# Altium schematic sheet leds.SchDoc
size A
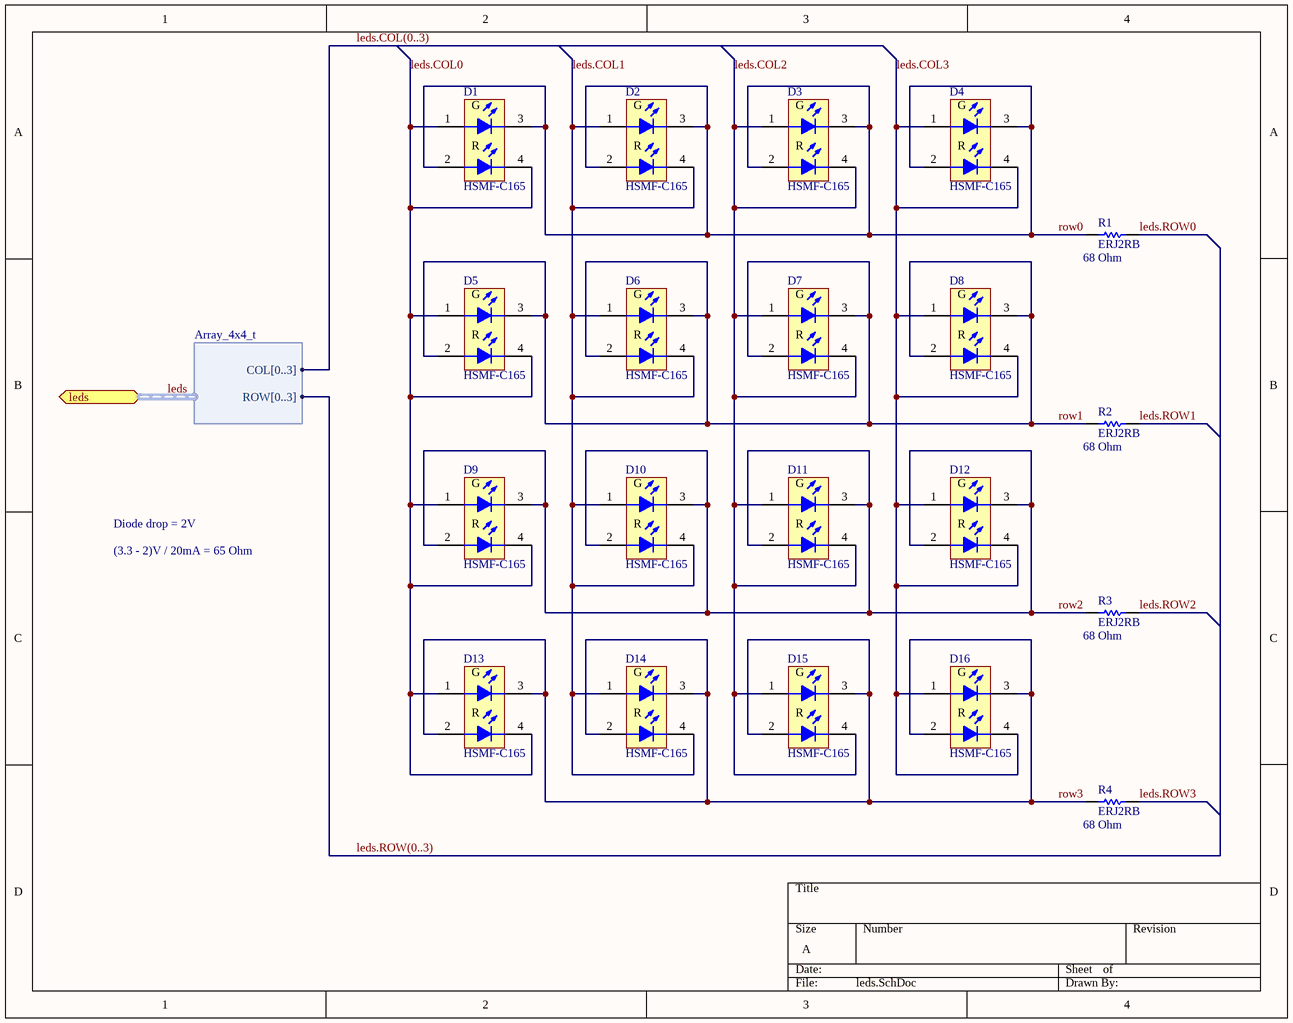
[diagram p0: leds.SchDoc]

## Parts
D1  HSMF-C165  [1.6X0.8X0.5]
D2  HSMF-C165  [1.6X0.8X0.5]
D3  HSMF-C165  [1.6X0.8X0.5]
D4  HSMF-C165  [1.6X0.8X0.5]
D5  HSMF-C165  [1.6X0.8X0.5]
D6  HSMF-C165  [1.6X0.8X0.5]
D7  HSMF-C165  [1.6X0.8X0.5]
D8  HSMF-C165  [1.6X0.8X0.5]
D9  HSMF-C165  [1.6X0.8X0.5]
D10  HSMF-C165  [1.6X0.8X0.5]
D11  HSMF-C165  [1.6X0.8X0.5]
D12  HSMF-C165  [1.6X0.8X0.5]
D13  HSMF-C165  [1.6X0.8X0.5]
D14  HSMF-C165  [1.6X0.8X0.5]
D15  HSMF-C165  [1.6X0.8X0.5]
D16  HSMF-C165  [1.6X0.8X0.5]
R1  ERJ2RB  value 68 Ohm  [2-0402]
R2  ERJ2RB  value 68 Ohm  [2-0402]
R3  ERJ2RB  value 68 Ohm  [2-0402]
R4  ERJ2RB  value 68 Ohm  [2-0402]

## Ports
leds (harness Array_4x4_t)

## Harnesses
Array_4x4_t: ROW[0..3], COL[0..3]

## Nets
leds.COL0: D1.1(A1) D1.4(K2) D5.1(A1) D5.4(K2) D9.1(A1) D9.4(K2) D13.1(A1) D13.4(K2)
leds.COL1: D2.1(A1) D2.4(K2) D6.1(A1) D6.4(K2) D10.1(A1) D10.4(K2) D14.1(A1) D14.4(K2)
leds.COL2: D3.1(A1) D3.4(K2) D7.1(A1) D7.4(K2) D11.1(A1) D11.4(K2) D15.1(A1) D15.4(K2)
leds.COL3: D4.1(A1) D4.4(K2) D8.1(A1) D8.4(K2) D12.1(A1) D12.4(K2) D16.1(A1) D16.4(K2)
leds.ROW0: R1.1
leds.ROW1: R2.1
leds.ROW2: R3.1
leds.ROW3: R4.1
row0: D1.2(A2) D1.3(K1) D2.2(A2) D2.3(K1) D3.2(A2) D3.3(K1) D4.2(A2) D4.3(K1) R1.2
row1: D5.2(A2) D5.3(K1) D6.2(A2) D6.3(K1) D7.2(A2) D7.3(K1) D8.2(A2) D8.3(K1) R2.2
row2: D9.2(A2) D9.3(K1) D10.2(A2) D10.3(K1) D11.2(A2) D11.3(K1) D12.2(A2) D12.3(K1) R3.2
row3: D13.2(A2) D13.3(K1) D14.2(A2) D14.3(K1) D15.2(A2) D15.3(K1) D16.2(A2) D16.3(K1) R4.2

## Buses and harness runs
bus leds.COL(0..3)
bus leds.ROW(0..3)
harness leds = port leds

## Notes on the sheet
- Diode drop = 2V
- (3.3 - 2)V / 20mA = 65 Ohm
- (in symbol HSMF-C165) G; R

## Library data of the parts
D1-D16 = HSMF-C165: Miniature Bi-Colour Surface Mount Chip LED (Red/Green); LuminousIntensity: 2.5mcd (Minimum).; LED_Colour: Red & Green; PCB_Layout: Complies with manufacturer's recommendation.; Published: 11-Dec-2002; DatasheetVersion: 6-Apr-2002; PackageVersion: 6-Apr-2002; PackageReference: 1.6X0.8X0.5; Publisher: Altium Limited; PackageDescription: SM LED, Bi-Colour; 4 Flat Leads; Body 1.6 x 0.8 x 0.5 mm (LxWxH); ComponentLink1Description: Manufacturer Link; ComponentLink1URL: http://www.avagotech.com/; ComponentLink2Description: Datasheet; ComponentLink2URL: http://cp.literature.agilent.com/litweb/pdf/5988-6146EN.pdf
R1-R4 = ERJ2RB: Precision Thick Film Chip Resistor, 10 Ohm to 1M Ohm Range, 1% and 0.5% Tolerance, 0402 Size, 0.063 W; Published: 17-Dec-2003; LatestRevisionDate: 19-Mar-2004; LatestRevisionNote: Silkscreen size reduced.; PackageDocument: Mar-2003; PackageReference: 2-0402; Publisher: Altium Limited; Code_IPC: 1005 [0402]; ComponentLink1Description: Manufacturer Link; ComponentLink1URL: http://www.panasonic.com/industrial/components/resistive_products.htm; ComponentLink2Description: Datasheet; ComponentLink2URL: http://www.panasonic.com/industrial/components/pdf/AOA0000CE2.pdf